# Altium project imu_Project.PrjPcb
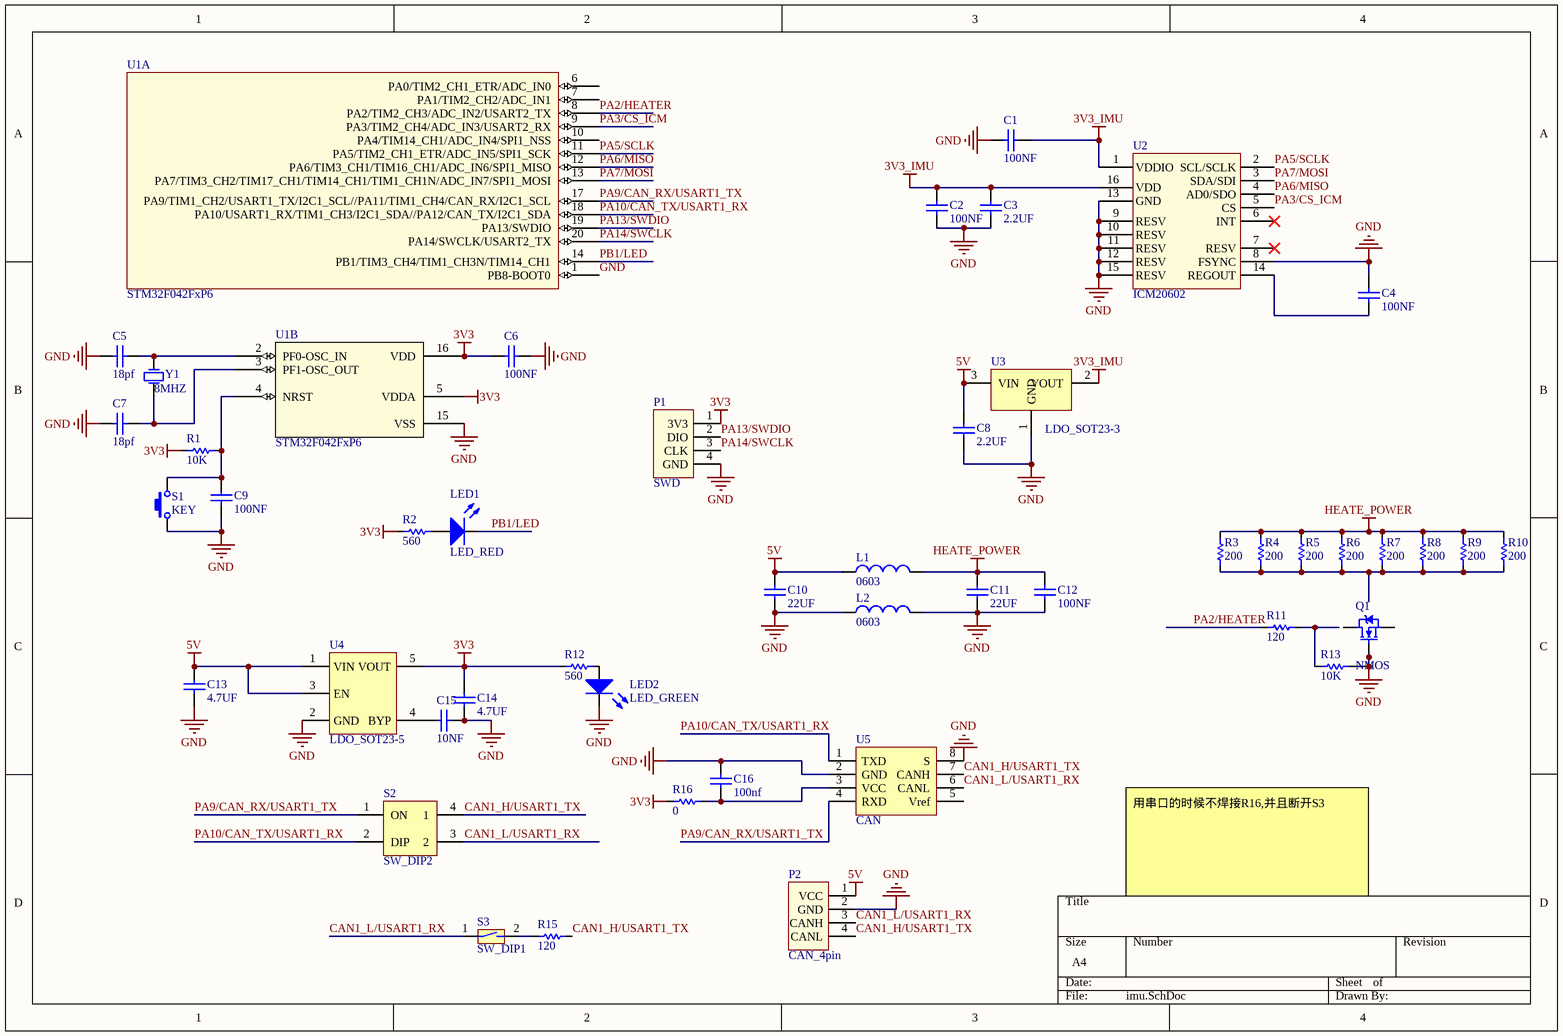
[diagram p0: imu.SchDoc]
1 sheet, 47 parts. Net scope: global (net labels, ports and power ports of the same name join across sheets).
Board file: imu.PcbDoc

## Sheet imu.SchDoc
size A4

### Parts
C1  100NF  [0402]
C2  100NF  [0402]
C3  2.2UF  [0402]
C4  100NF  [0402]
C5  18pf  [0402C]
C6  100NF  [0603C]
C7  18pf  [0402C]
C8  2.2UF  [0603C]
C9  100NF  [0603C]
C10  22UF  [0805c]
C11  22UF  [0805c]
C12  100NF  [0603C]
C13  4.7UF  [0603C]
C14  4.7UF  [0603C]
C15  10NF  [0603C]
C16  100nf  [0603C]
L1  0603  [0603]
L2  0603  [0603]
LED1  LED_RED  [0603LED_R]
LED2  LED_GREEN  [0603LED_R]
P1  SWD  [A1.25WF-4P]
P2  CAN_4pin  [HY2.00MM 4X1 SMT]
Q1  NMOS  [SOT-23-3]
R1  10K  [0603R]
R2  560  [0603R]
R3  200  [0603R]
R4  200  [0603R]
R5  200  [0603R]
R6  200  [0603R]
R7  200  [0603R]
R8  200  [0603R]
R9  200  [0603R]
R10  200  [0603R]
R11  120  [0603R]
R12  560  [0603R]
R13  10K  [0603R]
R15  120  [0603R]
R16  0  [0603R]
S1  KEY  [SW 3mmx4mm]
S2  SW_DIP2  [SW_DIP_2x2]
S3  SW_DIP1  [MSK-12C01-07]
U1  STM32F042FxP6  [TSSOP20]  (parts A,B of 2)
U2  ICM20602  [LGA-16]
U3  LDO_SOT23-3  [SOT-23-3]
U4  LDO_SOT23-5  [SOT-23-5 L]
U5  CAN  [SOT-23-8]
Y1  8MHZ  [NX3225GD]

### Nets
3V3: C6.2 C14.1 P1.1(3V3) R1.1 R2.1 R12.1 R16.1 U1.5(VDDA) U1.16(VDD) U4.5(VOUT)
3V3_IMU: C1.1 C2.2 C3.1 U2.1(VDDIO) U2.16(VDD) U3.2(VOUT)
5V: C8.1 C10.1 C13.2 L1.1 P2.1(VCC) U3.3(VIN) U4.1(VIN) U4.3(EN)
GND: C1.2 C2.1 C3.2 C4.1 C5.1 C6.1 C7.1 C8.2 C9.1 C10.2 C11.2 C12.2 C13.1 C14.2 C15.1 C16.1 L2.1 L2.2 LED2.2 P1.4(GND) P2.2(GND) Q1.1(G) R13.1 S1.1 U1.1(PB8-BOOT0) U1.15(VSS) U2.8(FSYNC) U2.9(RESV) U2.10(RESV) U2.11(RESV) U2.12(RESV) U2.13(GND) U2.15(RESV) U3.1(GND) U4.2(GND) U5.2(GND) U5.8(S)
HEATE_POWER: C11.1 C12.1 L1.2 R3.2 R4.2 R5.2 R6.2 R7.2 R8.2 R9.2 R10.2
CAN1_H/USART1_TX: P2.4(CANL) R15.2 S2.4(1) U5.7(CANH)
CAN1_L/USART1_RX: P2.3(CANH) S2.3(2) S3.1(ON) U5.6(CANL)
PA2/HEATER: R11.2 U1.8(PA2/TIM2_CH3/ADC_IN2/USART2_TX)
PA3/CS_ICM: U1.9(PA3/TIM2_CH4/ADC_IN3/USART2_RX) U2.5(CS)
PA5/SCLK: U1.11(PA5/TIM2_CH1_ETR/ADC_IN5/SPI1_SCK) U2.2(SCL/SCLK)
PA6/MISO: U1.12(PA6/TIM3_CH1/TIM16_CH1/ADC_IN6/SPI1_MISO) U2.4(AD0/SDO)
PA7/MOSI: U1.13(PA7/TIM3_CH2/TIM17_CH1/TIM14_CH1/TIM1_CH1N/ADC_IN7/SPI1_MOSI) U2.3(SDA/SDI)
PA9/CAN_RX/USART1_TX: S2.1(ON) U1.17(PA9/TIM1_CH2/USART1_TX/I2C1_SCL//PA11/TIM1_CH4/CAN_RX/I2C1_SCL) U5.4(RXD)
PA10/CAN_TX/USART1_RX: S2.2(DIP) U1.18(PA10/USART1_RX/TIM1_CH3/I2C1_SDA//PA12/CAN_TX/I2C1_SDA) U5.1(TXD)
PA13/SWDIO: P1.2(DIO) U1.19(PA13/SWDIO)
PA14/SWCLK: P1.3(CLK) U1.20(PA14/SWCLK/USART2_TX)
PB1/LED: LED1.2 U1.14(PB1/TIM3_CH4/TIM1_CH3N/TIM14_CH1)
NetC4_2: C4.2 U2.14(REGOUT)
NetC5_2: C5.2 U1.2(PF0-OSC_IN) Y1.2(OSC2)
NetC7_2: C7.2 U1.3(PF1-OSC_OUT) Y1.1(OSC1)
NetC9_2: C9.2 R1.2 S1.2 U1.4(NRST)
NetC15_2: C15.2 U4.4(BYP)
NetC16_2: C16.2 R16.2 U5.3(VCC)
NetLED1_1: LED1.1 R2.2
NetLED2_1: LED2.1 R12.2
NetR3_1: R3.1 R4.1 R5.1 R6.1 R7.1 R8.1 R9.1 R10.1
NetR11_1: R11.1 R13.2
NetR15_1: R15.1 S3.2(DIP)

Not connected (* = marked no-connect by the designer): Q1 2(S) 3(D); U1 6(PA0/TIM2_CH1_ETR/ADC_IN0) 7(PA1/TIM2_CH2/ADC_IN1) 10(PA4/TIM14_CH1/ADC_IN4/SPI1_NSS); U2 6(INT)* 7(RESV)*; U5 5(Vref)

### Notes on the sheet
- 用串口的时候不焊接R16,并且断开S3

### Library data of the parts
C1-C16 = Cap: Capacitor; Value: 100pF; Published: 8-Jun-2000; LatestRevisionDate: 17-Jul-2002; LatestRevisionNote: Re-released for DXP Platform.; PackageReference: RAD-0.3; Publisher: Altium Limited; PackageDescription: Radial Cap, Thru-Hole; 2 Leads; 0.3 in Pin Spacing
L1 L2 = Inductor: Code_IEC: 1005; Value: 10mH; Published: 8-Jun-2000; LatestRevisionDate: 29-May-2009; LatestRevisionNote: IPC-7351 Footprint Added.; PackageReference: 0402-A; Publisher: Altium Limited; PackageDescription: Chip Inductor; Code_JEITA: 0402
LED1 LED2 = LED: Typical RED, GREEN, YELLOW, AMBER GaAs LED; Published: 8-Jun-2000; LatestRevisionDate: 17-Jul-2002; LatestRevisionNote: Re-released for DXP Platform.; PackageVersion: Feb-2002; PackageReference: 3.2X1.6X1.1; Publisher: Altium Limited; PackageDescription: SM LED; 2 Flat Leads
P1 = SWD_HEADER
P2 = CAN_4pin: CAN 4pin，带5V电源，HY2.0-4A
Q1 = NMOS(SOT23): N-Channel Power MOSFET; Note: Pin 2 is electrically connected to pin 4.; Published: 8-Jun-2000; LatestRevisionDate: 17-Jul-2002; LatestRevisionNote: Re-released for DXP Platform.; DatasheetVersion: PD-9.814; PackageVersion: Feb-1997; PackageReference: TO-220AB; Publisher: Altium Limited; PackageDescription: TO, Thru-Hole, Vertical, Heatsink Mounted; 3 In-Line Leads; Pitch 2.54 mm; ComponentLink1Description: Manufacturer Link; ComponentLink1URL: http://www.irf.com/
R1-R13 R15 R16 = Res1: Resistor; Value: 1K; Published: 8-Jun-2000; LatestRevisionDate: 17-Jul-2002; LatestRevisionNote: Re-released for DXP Platform.; PackageReference: AXIAL-0.3; Publisher: Altium Limited; PackageDescription: Axial Device, Thru-Hole; 2 Leads; 0.3 in Pin Spacing
S1 = PushButton_2p: Button; Published: 24-Mar-1999; LatestRevisionDate: 17-Jul-2002; LatestRevisionNote: Re-released for DXP Platform.; PackageReference: SPST-2; Publisher: Altium Limited; PackageDescription: Switch; 2 Leads
S2 = SW_DIP 2
S3 = SW_DIP 1
U1 = STM32F042FxP6: Imported; Manufacturer_Part_Number: stm32f042gxu; Vendor: STMicroelectronics; Built_By: EMA_UL_Team; C: Copyright (C) 2016 Accelerated Designs. All rights reserved; RefDes: RefDes; Type: Type; Value: Value
Y1 = XTAL: Crystal Oscillator; Published: 8-Jun-2000; LatestRevisionDate: 17-Jul-2002; LatestRevisionNote: Re-released for DXP Platform.; PackageReference: R38; Publisher: Altium Limited; PackageDescription: Crystal, Thru-Hole; 2 Leads; Body 3.1 x 8.2 mm (Dia.xH)